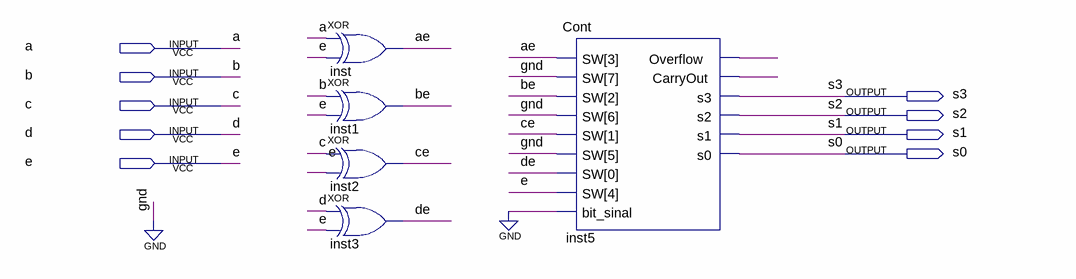
[diagram p0: schematic sheet]
// Quartus schematic Comp2.bdf as structural Verilog: 5 symbols, 9 pins
module Comp2 (
  input  a,
  input  b,
  input  c,
  input  d,
  input  e,
  output s3,
  output s2,
  output s1,
  output s0
);

  wire ae, be, ce, de, inst5_carryout, inst5_overflow;

  xor inst (ae, a, e);
  xor inst1 (be, b, e);
  xor inst2 (ce, c, e);
  xor inst3 (de, d, e);
  Cont inst5 (
    .SW({3'b000, e, ae, be, ce, de}), .bit_sinal(1'b0), .Overflow(inst5_overflow), .CarryOut(inst5_carryout),
    .s3(s3), .s2(s2), .s1(s1), .s0(s0));
endmodule
